# Altium schematic sheet MSP430.SchDoc
size A
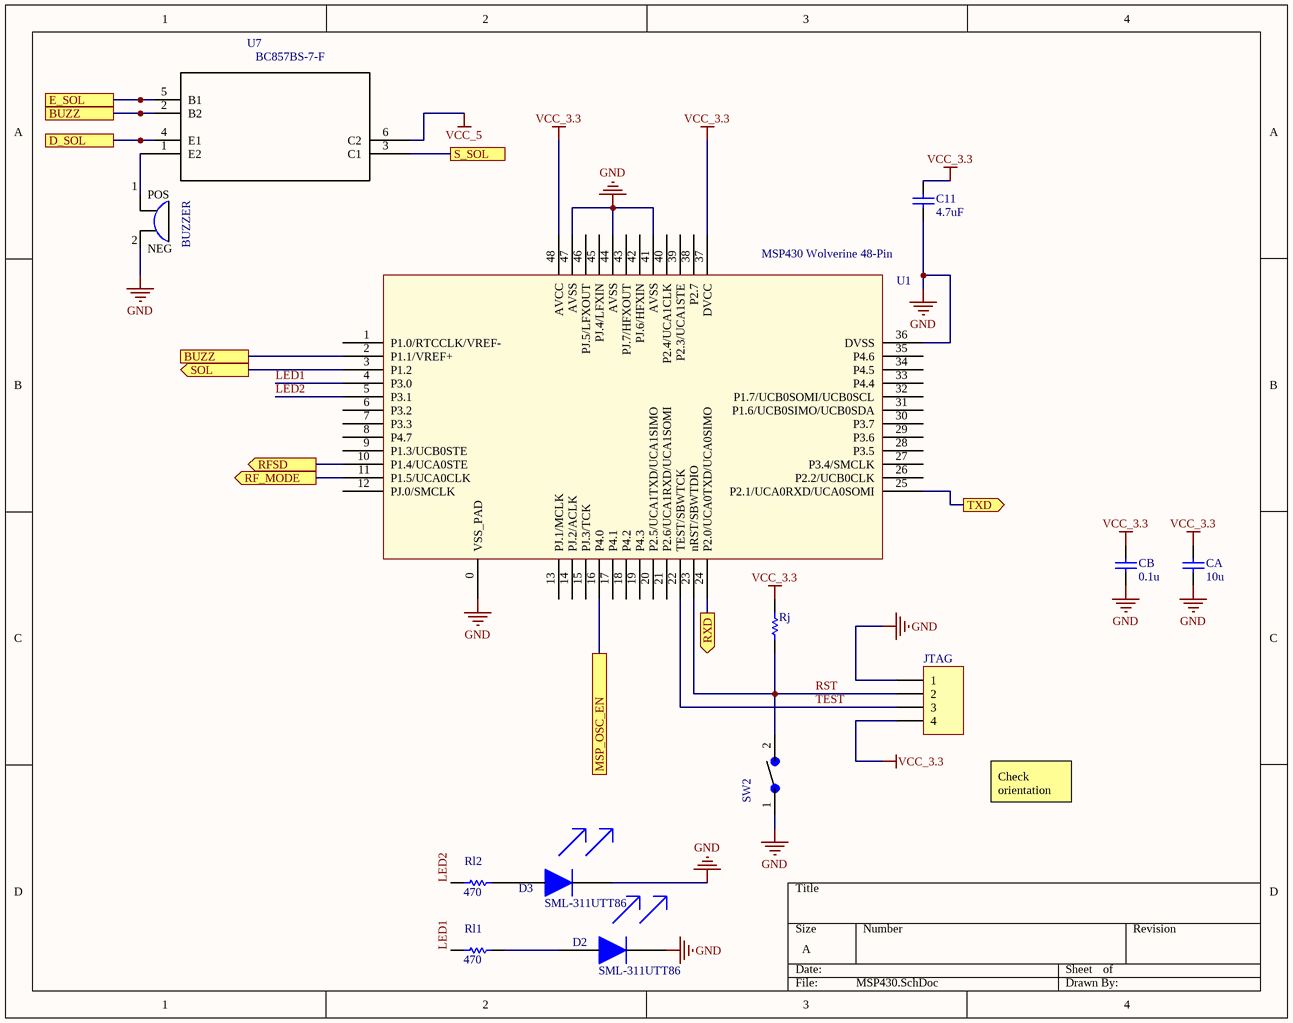
[diagram p0: MSP430.SchDoc]

## Parts
BUZZER  MCKPM-G1201A-K4037  [XDCR_MCKPM-G1201A-K4037]  (value not drawn)
C11  value 4.7uF  [0402-W]  (hidden comment: Cap)
CA  value 10u  [0402-W]  (hidden comment: Cap)
CB  value 0.1u  [0402-W]  (hidden comment: Cap)
D2  SML-311UTT86  [0603]
D3  SML-311UTT86  [0603]
JTAG  MHDR1X4  [MHDR1X4]  (value not drawn)
Rj  Res  [0402]  (value not drawn)
Rl1  value 470  [0402]  (hidden comment: Res)
Rl2  value 470  [0402]  (hidden comment: Res)
SW2  FSMSM _1437566-3_  [TE_FSMSM]  (value not drawn)
U1  MSP430 Wolverine 48-Pin  [MSP_QFN48_RGZ_PAD0]
U7  BC857BS-7-F  [SOT65P210X100-6N]

## Ports
BUZZ, D_SOL, E_SOL, MSP_OSC_EN, RF_MODE (out), RFSD (out), RXD (out), S_SOL, SOL (out), TXD (out)

## Nets
GND: BUZZER.2(NEG) C11.1 CA.1 CB.1 D2.2 D3.2 JTAG.1 SW2.1 U1.0(VSS_PAD) U1.36(DVSS) U1.41(AVSS) U1.44(AVSS) U1.47(AVSS)
VCC_3.3: C11.2 CA.2 CB.2 JTAG.4 Rj.2 U1.37(DVCC) U1.48(AVCC)
VCC_5: U7.6(C2)
BUZZ: U1.2(P1.1/VREF+) U7.2(B2) ; port BUZZ
D_SOL: U7.4(E1) ; port D_SOL
E_SOL: U7.5(B1) ; port E_SOL
LED1: Rl1.2 U1.4(P3.0)
LED2: Rl2.2 U1.5(P3.1)
MSP_OSC_EN: U1.16(P4.0) ; port MSP_OSC_EN
RF_MODE: U1.11(P1.5/UCA0CLK) ; port RF_MODE
RFSD: U1.10(P1.4/UCA0STE) ; port RFSD
RST: JTAG.2 Rj.1 SW2.2 U1.23(nRST/SBWTDIO)
RXD: U1.24(P2.0/UCA0TXD/UCA0SIMO) ; port RXD
S_SOL: U7.3(C1) ; port S_SOL
SOL: U1.3(P1.2) ; port SOL
TEST: JTAG.3 U1.22(TEST/SBWTCK)
TXD: U1.25(P2.1/UCA0RXD/UCA0SOMI) ; port TXD
NetBUZZER_1: BUZZER.1(POS) U7.1(E2)
NetD2_1: D2.1 Rl1.1
NetD3_1: D3.1 Rl2.1

Not connected (* = marked no-connect by the designer): U1 1(P1.0/RTCCLK/VREF-) 6(P3.2) 7(P3.3) 8(P4.7) 9(P1.3/UCB0STE) 12(PJ.0/SMCLK) 13(PJ.1/MCLK) 14(PJ.2/ACLK) 15(PJ.3/TCK) 17(P4.1) 18(P4.2) 19(P4.3) 20(P2.5/UCA1TXD/UCA1SIMO) 21(P2.6/UCA1RXD/UCA1SOMI) 26(P2.2/UCB0CLK) 27(P3.4/SMCLK) 28(P3.5) 29(P3.6) 30(P3.7) 31(P1.6/UCB0SIMO/UCB0SDA) 32(P1.7/UCB0SOMI/UCB0SCL) 33(P4.4) 34(P4.5) 35(P4.6) 38(P2.7) 39(P2.3/UCA1STE) 40(P2.4/UCA1CLK) 42(PJ.6/HFXIN) 43(PJ.7/HFXOUT) 45(PJ.4/LFXIN) 46(PJ.5/LFXOUT)

## Notes on the sheet
- Check orientation

## Library data of the parts
BUZZER = MCKPM-G1201A-K4037: Magnetic Buzzer And Transducer; MF: Multicomp; Availability: Unavailable; Package: None; MP: MCKPM-G1201A-K4037; Price: 0.24 USD; Value: *
C11 CA CB = Cap: Ceramic Capacitor (Surface Mount); Manufacturer: Generic Ceramic Chip Cap (TBD); Digi-Key Part Number: *; Manufacturer Part Number: *; Note: *; Rating: *
D2 D3 = SML-311UTT86: LED 630NM RED WTR CLR 0603 SMD
JTAG = MHDR1X4: Header, 4-Pin; LatestRevisionDate: 17-Jul-2002; LatestRevisionNote: Re-released for DXP Platform.; Publisher: Altium Limited
Rj Rl1 Rl2 = Res: Chip Resistor (Surface Mount); Manufacturer: Generic Chip Res (TBD); Manufacturer Part Number: *; Digi-Key Part Number: *; Rating: *
  Rj: Note: *
SW2 = FSMSM: FSMSM=3.5X6 SMT TACT; MF: TE Connectivity; Price: None; SnapEDA_Link: https://www.snapeda.com/parts/FSMSM/TE%20Connectivity%20/%20DEUTSCH/view-part/?ref=snap; MP: FSMSM; Availability: Unavailable; Package: None; Value: *
U1 = MSP430FR596X_586X_RGZ: 16-bit FRAM MCU
U7 = BC857BS-7-F: BC857BS Series PNP 45 V 200 mW Small Signal Transistor SMT - SOT-363; MF: Diodes Inc.; SnapEDA_Link: https://www.snapeda.com/parts/BC857BS-7-F/Diodes%20Inc./view-part/?ref=snap; MP: BC857BS-7-F; Availability: Good; Price: 0.08 USD; Package: SOT-363 Diodes Inc.; Value: *